# EAGLE design hatest (EAGLE 5.00)
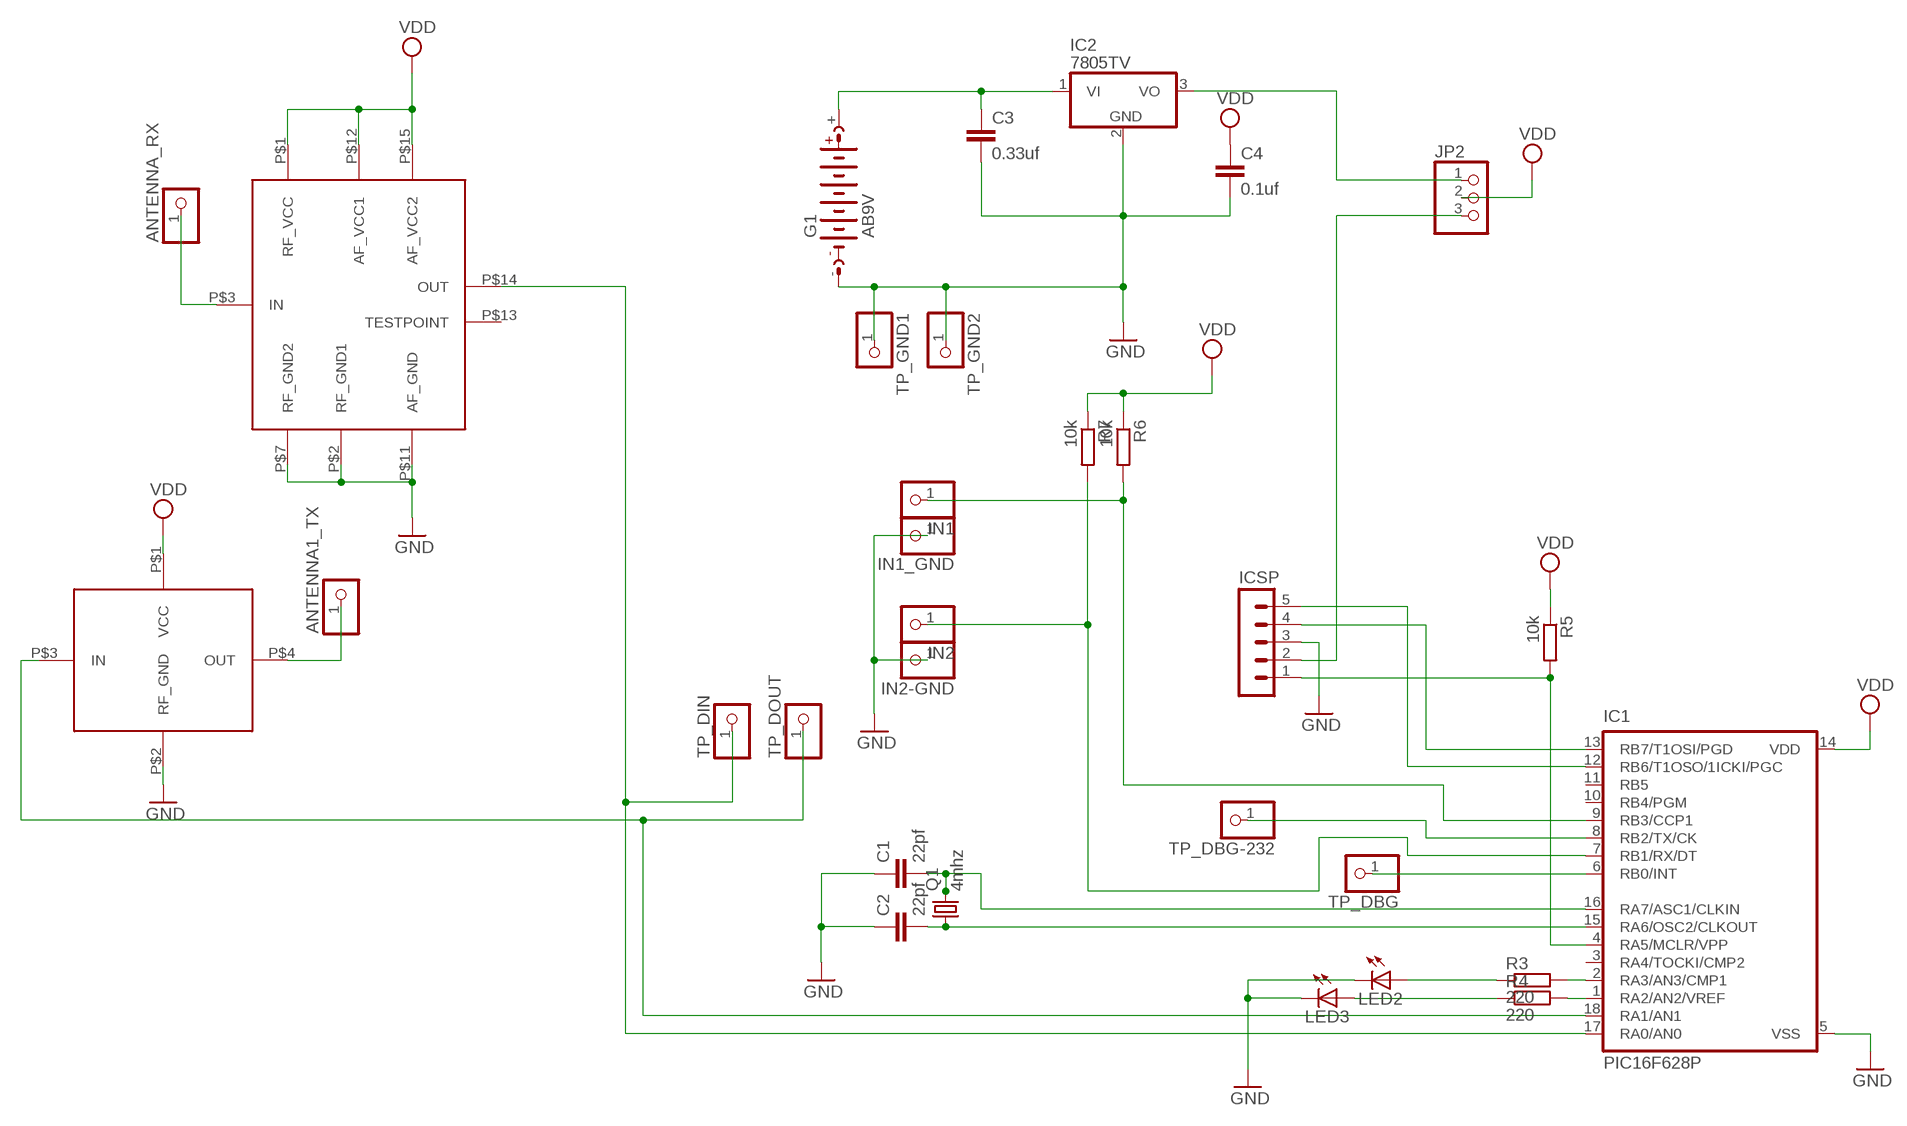
[diagram p0: schematic, sheet 1]

## Parts
ANTENNA1_TX  PINHD-1X1  [1X01]
ANTENNA_RX  PINHD-1X1  [1X01]
C1  22pf  C-EU075-032X103  [C075-032X103]
C2  22pf  C-EU075-032X103  [C075-032X103]
C3  0.33uf  C5/3  [C5B3]
C4  0.1uf  C5/3  [C5B3]
G1  AB9V  [AB9V]
IC1  PIC16F628P  [DIL18]
IC2  7805TV  [TO220V]
ICSP  MA05-1  [MA05-1]
IN1  PINHD-1X1  [1X01]
IN1_GND  PINHD-1X1  [1X01]
IN2  PINHD-1X1  [1X01]
IN2-GND  PINHD-1X1  [1X01]
JP2  PINHD-1X3  [1X03]
LED2  LED5MM  [LED5MM]
LED3  LED5MM  [LED5MM]
Q1  4mhz  CRYSTALHC49S  [HC49/S]
R3  220  R-EU_0204/5  [0204/5]
R4  220  R-EU_0204/5  [0204/5]
R5  10k  R-EU_0309/12  [0309/12]
R6  10k  R-EU_0204/5  [0204/5]
R7  10k  R-EU_0204/5  [0204/5]
TP_DBG  PINHD-1X1  [1X01]
TP_DBG-232  PINHD-1X1  [1X01]
TP_DIN  PINHD-1X1  [1X01]
TP_DOUT  PINHD-1X1  [1X01]
TP_GND1  PINHD-1X1  [1X01]
TP_GND2  PINHD-1X1  [1X01]
U$1  RR4  [SIL15]
U$2  RR5  [DIL4]

## Nets
9V: C3.1 G1.+ IC2.1(VI)
ANTENNA: ANTENNA_RX.1 U$1.P$3(IN)
GND: C1.1 C2.1 C3.2 C4.2 G1.- IC1.5(VSS) IC2.2(GND) ICSP.3 IN1_GND.1 IN2-GND.1 LED2.K(C) LED3.K(C) TP_GND1.1 TP_GND2.1 U$1.P$2(RF_GND1) U$1.P$7(RF_GND2) U$1.P$11(AF_GND) U$2.P$2(RF_GND)
N$1: C1.2 IC1.16(RA7/ASC1/CLKIN) Q1.2
N$2: C2.2 IC1.15(RA6/OSC2/CLKOUT) Q1.1
N$4: LED2.A R3.1
N$5: LED3.A R4.1
N$6: IC1.9(RB3/CCP1) IN1.1 R6.2
N$7: IC1.2(RA3/AN3/CMP1) R3.2
N$8: IC1.1(RA2/AN2/VREF) R4.2
N$9: IC1.4(RA5/MCLR/VPP) ICSP.1 R5.2
N$10: IC1.13(RB7/T1OSI/PGD) ICSP.4
N$11: IC1.7(RB1/RX/DT) IN2.1 R7.2
N$12: IC1.12(RB6/T1OSO/1ICKI/PGC) ICSP.5
N$13: IC1.17(RA0/AN0) TP_DIN.1 U$1.P$14(OUT)
N$14: IC1.6(RB0/INT) TP_DBG.1
N$15: ANTENNA1_TX.1 U$2.P$4(OUT)
N$16: IC1.18(RA1/AN1) TP_DOUT.1 U$2.P$3(IN)
N$17: IC1.8(RB2/TX/CK) TP_DBG-232.1
N$21: ICSP.2 JP2.3
PROGRUN: IC2.3(VO) JP2.1
VDD: C4.1 IC1.14(VDD) JP2.2 R5.1 R6.1 R7.1 U$1.P$1(RF_VCC) U$1.P$12(AF_VCC1) U$1.P$15(AF_VCC2) U$2.P$1(VCC)
Unconnected: IC1.3(RA4/TOCKI/CMP2) IC1.10(RB4/PGM) IC1.11(RB5) U$1.P$13(TESTPOINT)

## Library data of the parts
ANTENNA1_TX ANTENNA_RX IN1 IN1_GND IN2 IN2-GND TP_DBG TP_DBG-232 TP_DIN TP_DOUT TP_GND1 TP_GND2 = pinhead:PINHD-1X1: PIN HEADER
C1 C2 = resistor:C-EU: CAPACITOR, European symbol
C3 C4 = capacitor-wima:C: CAPACITOR naming: grid - package width
G1 = battery:AB9V: 9-V BATTERY CLIP
IC1 = microchip:PIC16*F62: FLASH-Based 8-Bit CMOS Microcontroller Source: http://ww1.microchip.com/downloads/en/DeviceDoc/40300C.pdf
IC2 = linear:78*: Positive VOLTAGE REGULATOR Source: http://cache.national.com/ds/LM/LM78L05.pdf http://www.fairchildsemi.com/ds/LM/LM7805.pdf
ICSP = con-lstb:MA05-1: PIN HEADER
JP2 = pinhead:PINHD-1X3: PIN HEADER
LED2 LED3 = led:LED: LED OSRAM: - CHIPLED LG R971, LG N971, LY N971, LG Q971, LY Q971, LO R971, LY R971 LH N974, LH R974 LS Q976, LO Q976, LY Q976 LO Q996 - Hyper CHIPLED LW Q18S LB Q993, LB Q99A, LB R99A - SideLED LS A670, LO A670, LY A670, LG A670, LP A670 LB A673, LV A673, LT A673, LW A673 LH A674 LY A675 LS A676, LA A676, LO A676, LY A676, LW A676 LS A679, LY A679, LG A679 - Hyper Micro SIDELED® LS Y876, LA Y876, LO Y876, LY Y876 LT Y87S - SmartLED LW L88C, LW L88S LB L89C, LB L89S, LG L890 LS L89K, LO L89K, LY L89K LS L896, LA L896, LO L896, LY L896 - TOPLED LS T670, LO T670, LY T670, LG T670, LP T670 LSG T670, LSP T670, LSY T670, LOP T670, LYG T670 LG T671, LOG T671, LSG T671 LB T673, LV T673, LT T673, LW T673 LH T674 LS T676, LA T676, LO T676, LY T676, LB T676, LH T676, LSB T676, LW T676 LB T67C, LV T67C, LT T67C, LS T67K, LO T67K, LY T67K, LW E67C LS E67B, LA E67B, LO E67B, LY E67B, LB E67C, LV E67C, LT E67C LW T67C LS T679, LY T679, LG T679 LS T770, LO T770, LY T770, LG T770, LP T770 LB T773, LV T773, LT T773, LW T773 LH T774 LS E675, LA E675, LY E675, LS T675 LS T776, LA T776, LO T776, LY T776, LB T776 LHGB T686 LT T68C, LB T68C - Hyper Mini TOPLED® LB M676 - Mini TOPLED Santana® LG M470 LS M47K, LO M47K, LY M47K Source: http://www.osram.convergy.de - LUMILED® LXK2-PW12-R00, LXK2-PW12-S00, LXK2-PW14-U00, LXK2-PW14-V00 LXK2-PM12-R00, LXK2-PM12-S00, LXK2-PM14-U00 LXK2-PE12-Q00, LXK2-PE12-R00, LXK2-PE12-S00, LXK2-PE14-T00, LXK2-PE14-U00 LXK2-PB12-K00, LXK2-PB12-L00, LXK2-PB12-M00, LXK2-PB14-N00, LXK2-PB14-P00, LXK2-PB14-Q00 LXK2-PR12-L00, LXK2-PR12-M00, LXK2-PR14-Q00, LXK2-PR14-R00 LXK2-PD12-Q00, LXK2-PD12-R00, LXK2-PD12-S00 LXK2-PH12-R00, LXK2-PH12-S00 LXK2-PL12-P00, LXK2-PL12-Q00, LXK2-PL12-R00 Source: www.luxeon.com
Q1 = crystal:CRYSTAL: CRYSTAL
R3-R7 = rcl:R-EU_: RESISTOR, European symbol
U$1 = rf:RR4
U$2 = rf:RR5

## Board
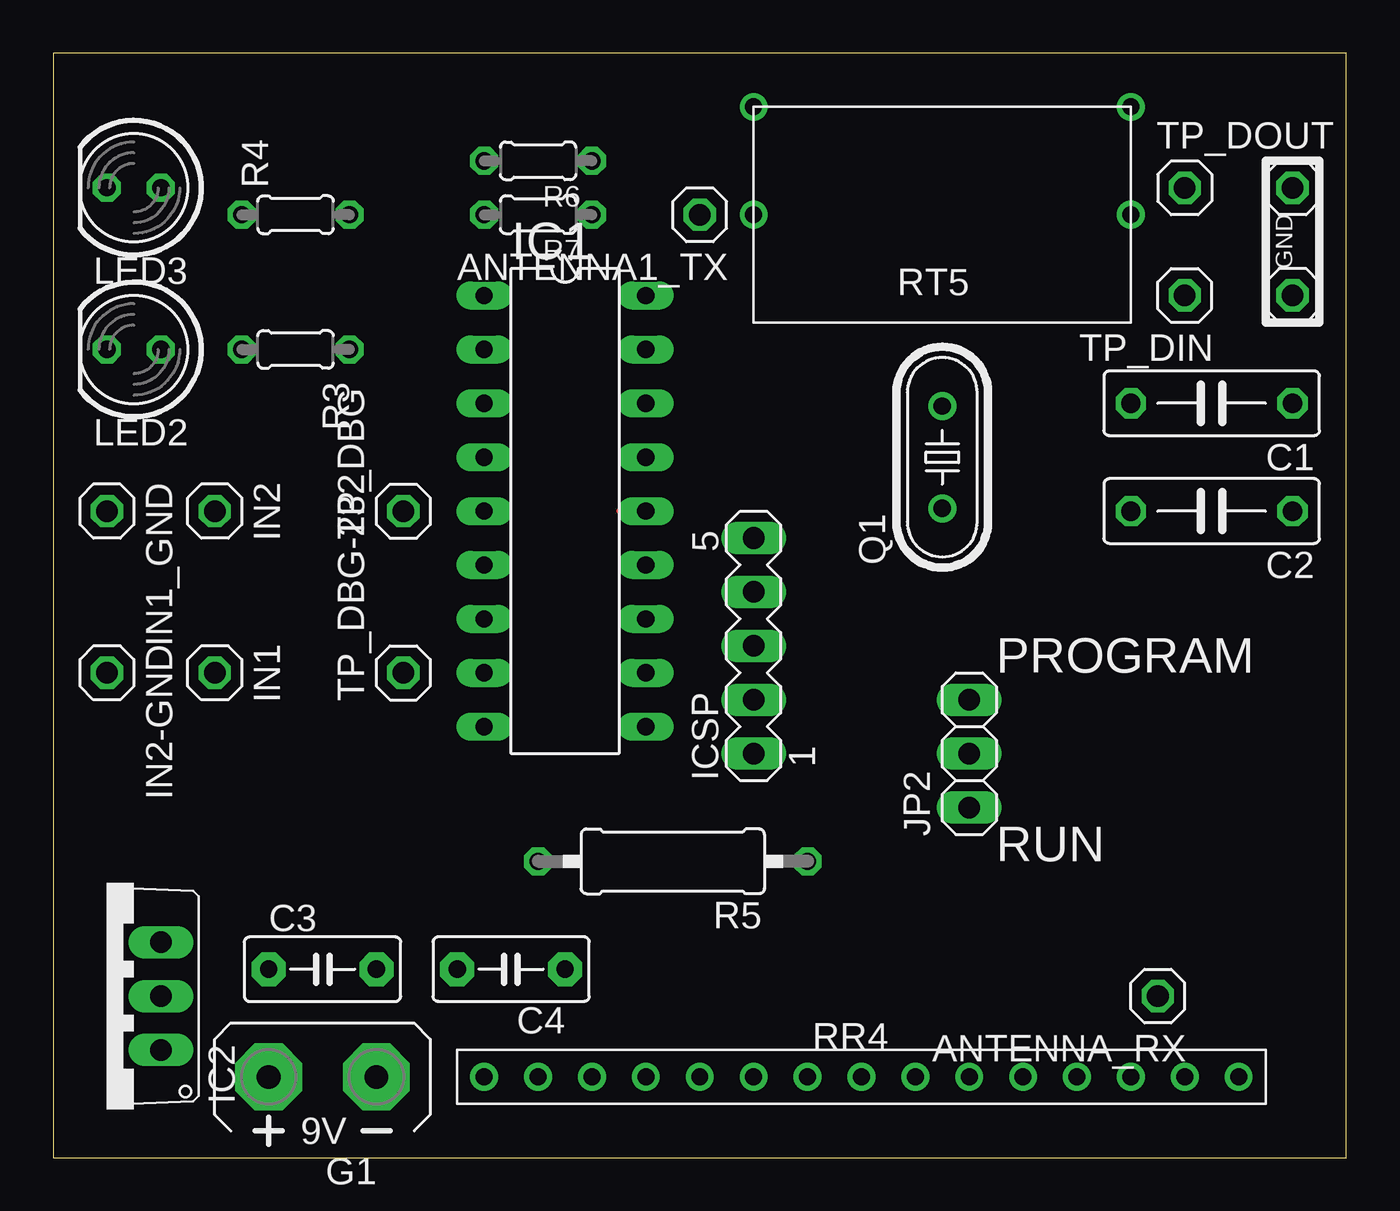
[diagram p1: board, top side]
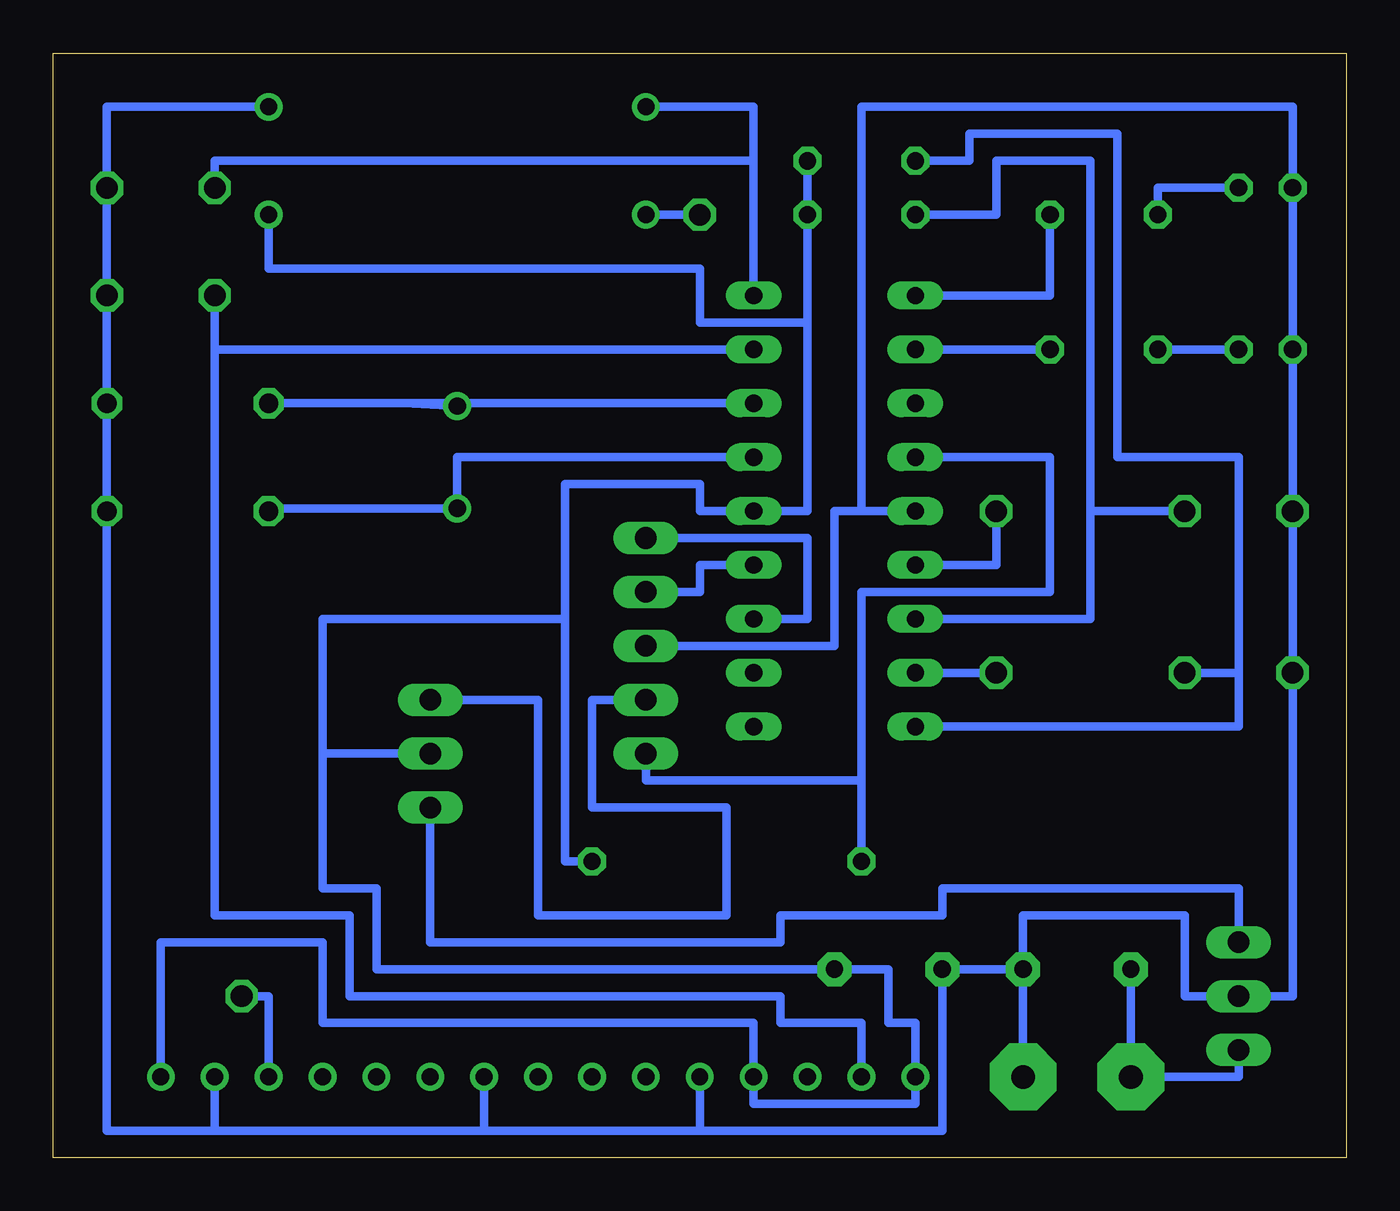
[diagram p2: board, bottom side, seen from below]

Size 60.96 x 52.07 mm. Coordinates in mm from the lower left corner, seen from the top.
Outline: 0,0 60.96,0 60.96,52.07 0,52.07 0,0
Copper layers (1*16): Top 0.035mm / dielectric 1.5mm / Bottom 0.035mm
Design rules "default": minimum track width 10mil, minimum drill 24mil, track to track 8mil, track to pad 8mil, pad to pad 8mil, via to via 8mil, smd to smd 8mil, copper to edge 40mil, drill to drill 8mil, minimum pad ring 10mil, minimum via ring 8mil, stop-mask expansion 4mil, vias tented up to drill 0mil, thermal gap 10mil

### Footprints (pad centres in the part's own frame; a part is rotated, then mirrored left to right if it is on the bottom)
1X01 = drill 1.016 octagon: 1 0,0
C075-032X103 = drill 0.914 octagon: 1 -3.81,0; 2 3.81,0
C5B3 = drill 0.813 pad 1.6 octagon: 1 -2.54,0; 2 2.54,0
AB9V = drill 1.118 pad 3.15 octagon: + 0,2.54; - 0,-2.54
DIL18 = drill 0.813 long: 1 -10.16,-3.81; 2 -7.62,-3.81; 3 -5.08,-3.81; 4 -2.54,-3.81; 5 0,-3.81; 6 2.54,-3.81; 7 5.08,-3.81; 8 7.62,-3.81; 9 10.16,-3.81; 10 10.16,3.81; 11 7.62,3.81; 12 5.08,3.81; 13 2.54,3.81; 14 0,3.81; 15 -2.54,3.81; 16 -5.08,3.81; 17 -7.62,3.81; 18 -10.16,3.81
TO220V = drill 1.016 long: 1 -2.54,-2.54; 2 0,-2.54; 3 2.54,-2.54
MA05-1 = drill 1.016 long: 1 -5.08,0; 2 -2.54,0; 3 0,0; 4 2.54,0; 5 5.08,0
1X03 = drill 1.016 long: 1 -2.54,0; 2 0,0; 3 2.54,0
LED5MM = drill 0.813 octagon: A -1.27,0; K 1.27,0
HC49/S = drill 0.813 round: 1 -2.413,0; 2 2.413,0
0204/5 = drill 0.813 octagon: 1 -2.54,0; 2 2.54,0
0309/12 = drill 0.813 octagon: 1 -6.35,0; 2 6.35,0
SIL15 = drill 0.8 round: P$1 -17.78,0; P$2 -15.24,0; P$3 -12.7,0; P$4 -10.16,0; P$5 -7.62,0; P$6 -5.08,0; P$7 -2.54,0; P$8 0,0; P$9 2.54,0; P$10 5.08,0; P$11 7.62,0; P$12 10.16,0; P$13 12.7,0; P$14 15.24,0; P$15 17.78,0
DIL4 = drill 0.8 round: P$1 -8.89,0; P$2 -8.89,-5.08; P$3 8.89,-5.08; P$4 8.89,0

### Placement (x,y rotation side)
ANTENNA1_TX  30.48,44.45 180 top
ANTENNA_RX  52.07,7.62 180 top
C1  54.61,35.56 180 top
C2  54.61,30.48 180 top
C3  12.7,8.89 0 top
C4  21.59,8.89 180 top
G1  12.7,3.81 90 top
IC1  24.13,30.48 270 top
IC2  2.54,7.62 90 top
ICSP  33.02,24.13 90 top
IN1  7.62,22.86 270 top
IN1_GND  2.54,30.48 270 top
IN2  7.62,30.48 270 top
IN2-GND  2.54,22.86 270 top
JP2  43.18,19.05 90 top
LED2  3.81,38.1 180 top
LED3  3.81,45.72 180 top
Q1  41.91,33.02 90 top
R3  11.43,38.1 0 top
R4  11.43,44.45 0 top
R5  29.21,13.97 180 top
R6  22.86,46.99 180 top
R7  22.86,44.45 180 top
TP_DBG  16.51,30.48 90 top
TP_DBG-232  16.51,22.86 90 top
TP_DIN  53.34,40.64 180 top
TP_DOUT  53.34,45.72 0 top
TP_GND1  58.42,40.64 270 top
TP_GND2  58.42,45.72 270 top
U$1  38.1,3.81 180 top
U$2  41.91,44.45 180 top

### Tracks (layer width: path | path; a pad name or v marks a point on that pad's centre or on a via)
9V
  Bottom 0.406: IC2.1 5.08,3.81 G1.+ C3.1
ANTENNA
  Bottom 0.406: U$1.P$3 50.8,7.62 ANTENNA_RX.1
GND
  Bottom 0.406: 22.86,30.48 IC1.5 | 22.86,30.48 22.86,49.53 2.54,49.53 LED3.K LED2.K IN1_GND.1 IN2-GND.1 2.54,7.62 IC2.2 7.62,7.62 7.62,11.43 15.24,11.43 C3.2 | 22.86,30.48 24.13,30.48 24.13,24.13 ICSP.3 | C3.2 G1.- | C3.2 C4.2 19.05,1.27 30.48,1.27 | U$2.P$2 58.42,49.53 TP_GND2.1 TP_GND1.1 C1.1 C2.1 58.42,1.27 53.34,1.27 | 30.48,1.27 U$1.P$11 | 40.64,1.27 U$1.P$7 | 30.48,1.27 40.64,1.27 | 53.34,1.27 U$1.P$2 | 40.64,1.27 53.34,1.27
N$1
  Bottom 0.406: IC1.16 44.45,35.56 | 44.45,35.56 Q1.2 | 44.45,35.56 C1.2
N$2
  Bottom 0.406: C2.2 50.8,30.61 Q1.1 41.91,33.02 IC1.15
N$4
  Bottom 0.406: LED2.A R3.1
N$5
  Bottom 0.406: LED3.A 8.89,45.72 R4.1
N$6
  Bottom 0.406: R6.2 17.78,46.99 17.78,48.26 10.79,48.26 10.79,33.02 5.08,33.02 5.08,22.86 | IC1.9 5.08,20.32 5.08,22.86 | 5.08,22.86 IN1.1
N$7
  Bottom 0.406: R3.2 IC1.2
N$8
  Bottom 0.406: R4.2 13.97,40.64 IC1.1
N$9
  Bottom 0.406: IC1.4 13.97,33.02 13.97,26.67 22.86,26.67 22.86,17.78 | 22.86,17.78 33.02,17.78 ICSP.1 | R5.2 22.86,17.78
N$10
  Bottom 0.406: IC1.13 30.48,27.94 30.48,26.67 ICSP.4
N$11
  Bottom 0.406: IC1.7 12.06,25.4 12.06,30.48 | R7.2 16.51,44.45 16.51,46.99 12.06,46.99 12.06,30.48 | IN2.1 12.06,30.48
N$12
  Bottom 0.406: IC1.12 25.4,25.4 25.4,29.21 ICSP.5
N$13
  Bottom 0.406: U$1.P$14 22.86,6.35 26.67,6.35 26.67,7.62 46.99,7.62 46.99,11.43 53.34,11.43 TP_DIN.1 53.34,38.1 IC1.17
N$14
  Bottom 0.406: TP_DBG.1 16.51,27.94 IC1.6
N$15
  Bottom 0.406: ANTENNA1_TX.1 U$2.P$4
N$16
  Bottom 0.406: IC1.18 27.94,46.99 | 27.94,46.99 27.94,49.53 U$2.P$3 | TP_DOUT.1 53.34,46.99 27.94,46.99
N$17
  Bottom 0.406: TP_DBG-232.1 IC1.8
N$21
  Bottom 0.406: ICSP.2 35.56,21.59 35.56,16.51 29.21,16.51 29.21,11.43 38.1,11.43 38.1,21.59 JP2.3
PROGRUN
  Bottom 0.406: IC2.3 5.08,12.7 19.05,12.7 19.05,11.43 26.67,11.43 26.67,10.16 43.18,10.16 JP2.1
VDD
  Top 0.254: IC1.14 26.67,30.48
  Bottom 0.406: 36.83,25.4 36.83,13.97 R5.1 | 36.83,25.4 36.83,31.75 30.48,31.75 30.48,30.48 IC1.14 25.4,30.48 25.4,39.37 | U$2.P$1 50.8,41.91 30.48,41.91 30.48,39.37 25.4,39.37 | U$1.P$1 55.88,10.16 48.26,10.16 48.26,6.35 27.94,6.35 U$1.P$12 27.94,2.54 20.32,2.54 U$1.P$15 20.32,6.35 21.59,6.35 21.59,8.89 C4.1 45.72,8.89 45.72,12.7 48.26,12.7 48.26,19.05 | 36.83,25.4 48.26,25.4 48.26,19.05 | 48.26,19.05 JP2.2 | R7.1 R6.1 25.4,39.37

### Text on the board
tNames: GND | PROGRAM | RUN